# Altium schematic sheet EP3C25.SchDoc
size A2
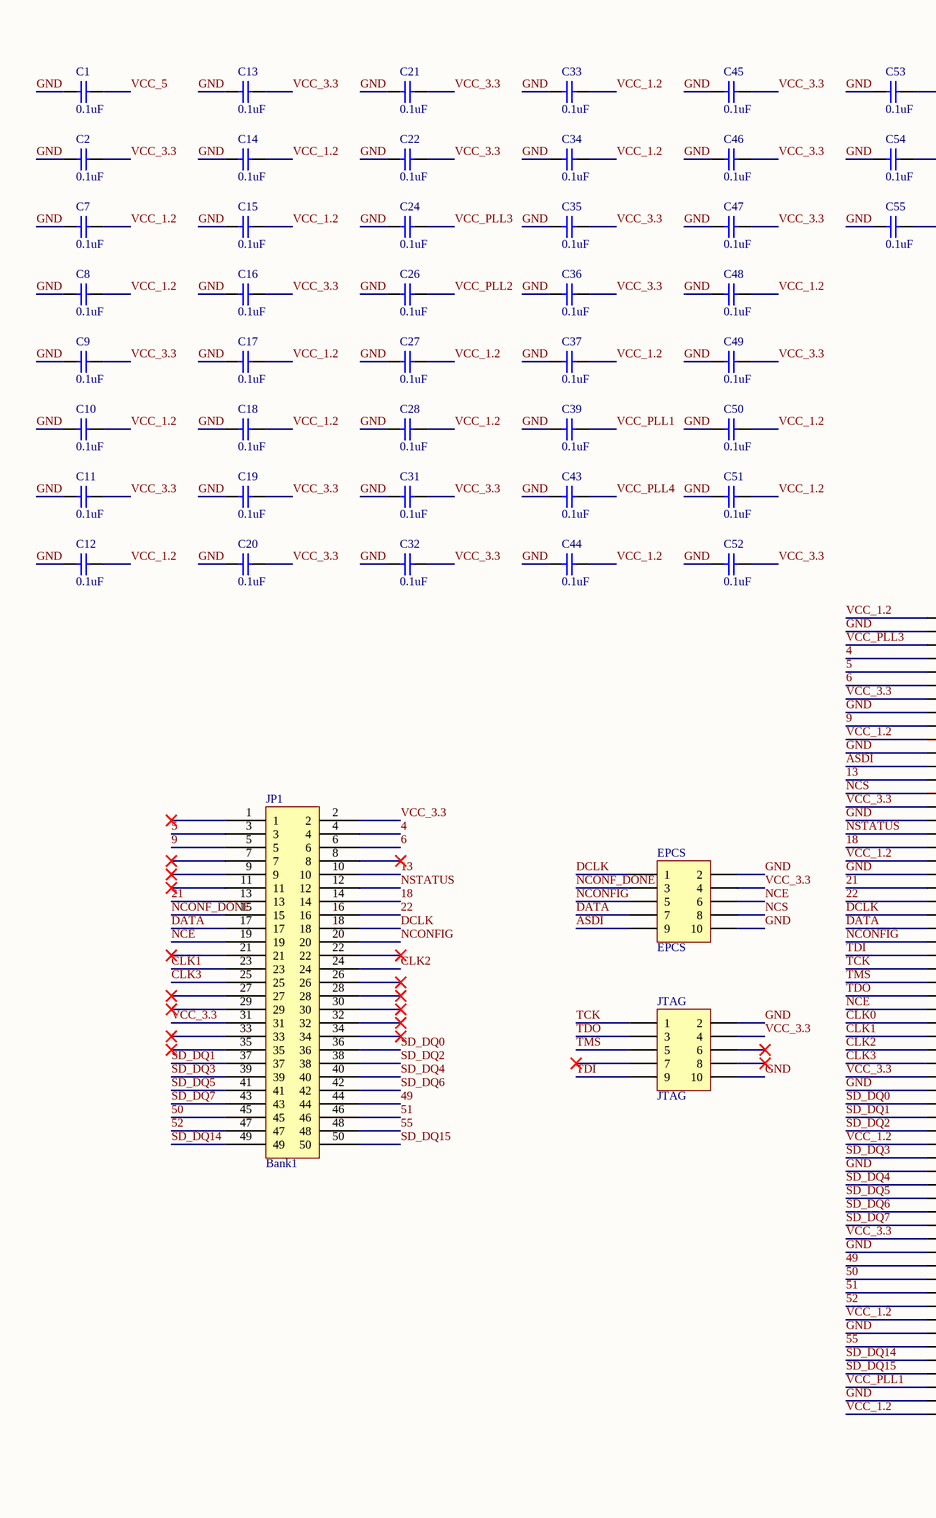
[diagram p0: EP3C25.SchDoc, left]
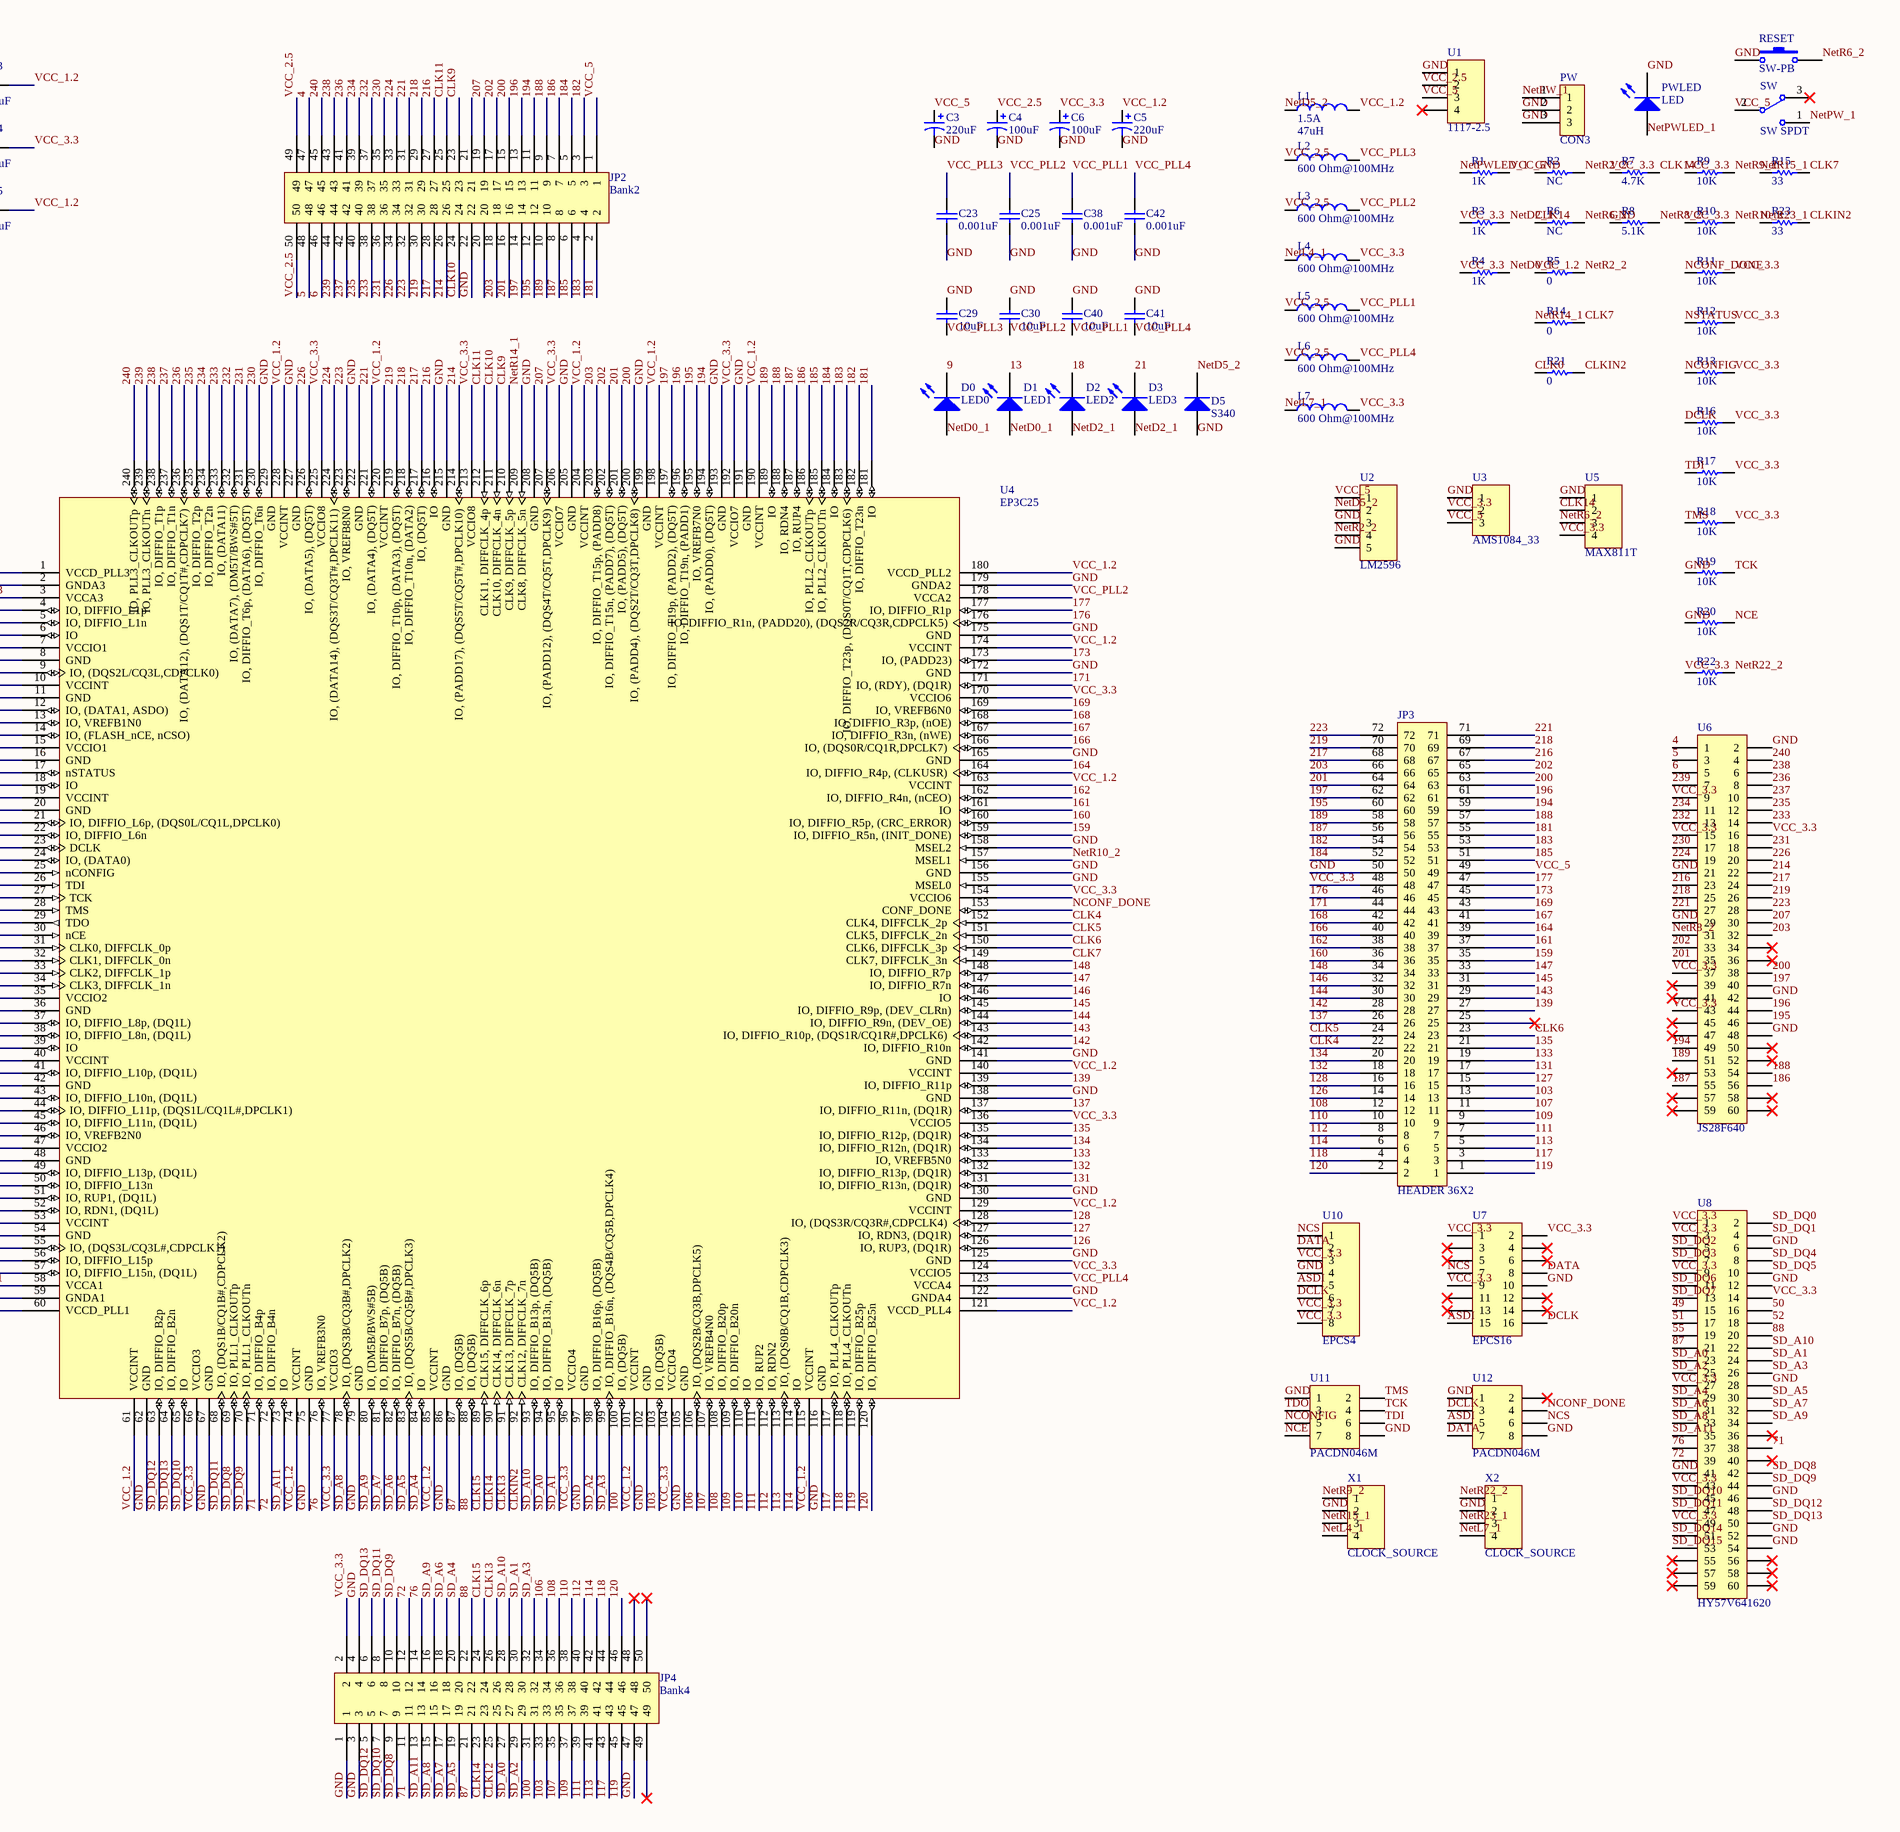
[diagram p1: EP3C25.SchDoc, right]

## Parts
C1  0.1uF  [0805C]
C2  0.1uF  [0805C]
C3  220uF  [Cap6.6*6.6]
C4  100uF  [Cap6.6*6.6]
C5  220uF  [8228]
C6  100uF  [Cap6.6*6.6]
C7  0.1uF  [0805C]
C8  0.1uF  [0805C]
C9  0.1uF  [0805C]
C10  0.1uF  [0805C]
C11  0.1uF  [0805C]
C12  0.1uF  [0805C]
C13  0.1uF  [0805C]
C14  0.1uF  [0805C]
C15  0.1uF  [0805C]
C16  0.1uF  [0805C]
C17  0.1uF  [0805C]
C18  0.1uF  [0805C]
C19  0.1uF  [0805C]
C20  0.1uF  [0805C]
C21  0.1uF  [0805C]
C22  0.1uF  [0805C]
C23  0.001uF  [0805C]
C24  0.1uF  [0805C]
C25  0.001uF  [0805C]
C26  0.1uF  [0805C]
C27  0.1uF  [0805C]
C28  0.1uF  [0805C]
C29  10uF  [3216C/A]
C30  10uF  [3216C/A]
C31  0.1uF  [0805C]
C32  0.1uF  [0805C]
C33  0.1uF  [0805C]
C34  0.1uF  [0805C]
C35  0.1uF  [0805C]
C36  0.1uF  [0805C]
C37  0.1uF  [0805C]
C38  0.001uF  [0805C]
C39  0.1uF  [0805C]
C40  10uF  [3216C/A]
C41  10uF  [3216C/A]
C42  0.001uF  [0805C]
C43  0.1uF  [0805C]
C44  0.1uF  [0805C]
C45  0.1uF  [0805C]
C46  0.1uF  [0805C]
C47  0.1uF  [0805C]
C48  0.1uF  [0805C]
C49  0.1uF  [0805C]
C50  0.1uF  [0805C]
C51  0.1uF  [0805C]
C52  0.1uF  [0805C]
C53  0.1uF  [0805C]
C54  0.1uF  [0805C]
C55  0.1uF  [0805C]
D0  LED0  [0805A]
D1  LED1  [0805A]
D2  LED2  [0805A]
D3  LED3  [0805A]
D5  S340  [SMB]
EPCS  EPCS  [IDC10_S]
JP1  Bank1  [IDC50-S]
JP2  Bank2  [IDC50-S]
JP3  HEADER 36X2  [IDC72_S]
JP4  Bank4  [IDC50-S]
JTAG  JTAG  [IDC10_S]
L1  1.5A  value 47uH  [临时画的电感封装]
L2  600 Ohm@100MHz  [0805R]
L3  600 Ohm@100MHz  [0805R]
L4  600 Ohm@100MHz  [0805R]
L5  600 Ohm@100MHz  [0805R]
L6  600 Ohm@100MHz  [0805R]
L7  600 Ohm@100MHz  [0805R]
PW  CON3  [PW_PORT]
PWLED  LED  [0805A]
R1  1K  [0805R]
R2  NC  [0805R]
R3  1K  [0805R]
R4  1K  [0805R]
R5  0  [0805R]
R6  NC  [0805R]
R7  4.7K  [0805R]
R8  5.1K  [0805R]
R9  10K  [0805R]
R10  10K  [0805R]
R11  10K  [0805R]
R12  10K  [0805R]
R13  10K  [0805R]
R14  0  [0805R]
R15  33  [0805R]
R16  10K  [0805R]
R17  10K  [0805R]
R18  10K  [0805R]
R19  10K  [0805R]
R20  10K  [0805R]
R21  0  [0805R]
R22  10K  [0805R]
R23  33  [0805R]
RESET  SW-PB  [SMD_SWITH]
SW  SW SPDT  [PW_SW]
U1  1117-2.5  [SOT-223]
U2  LM2596  [LM2596_TO263]
U3  AMS1084_33  [AMS1084-ADJ]
U4  EP3C25  [PQFP240]
U5  MAX811T  [SOT143]
U6  JS28F640  [SOP56_E28F640]
U7  EPCS16  [SOP16_EPCS16]
U8  HY57V641620  [TSOP54]
U10  EPCS4  [so8]
U11  PACDN046M  [MSOP8]
U12  PACDN046M  [MSOP8]
X1  CLOCK_SOURCE  [CRYSTAL4]
X2  CLOCK_SOURCE  [CRYSTAL4]

## Nets
4: JP1.4 JP2.47 U4.4(IO,_DIFFIO_L1p) U6.1
5: JP1.3 JP2.48 U4.5(IO,_DIFFIO_L1n) U6.3
6: JP1.6 JP2.46 U4.6(IO) U6.5
9: D0.2(K) JP1.5 U4.9(IO,_(DQS2L/CQ3L,CDPCLK0))
13: D1.2(K) JP1.10 U4.13(IO,_VREFB1N0)
18: D2.2(K) JP1.14 U4.18(IO)
21: D3.2(K) JP1.13 U4.21(IO,_DIFFIO_L6p,_(DQS0L/CQ1L,DPCLK0))
22: JP1.16 U4.22(IO,_DIFFIO_L6n)
49: JP1.44 U4.49(IO,_DIFFIO_L13p,_(DQ1L)) U8.15
50: JP1.45 U4.50(IO,_DIFFIO_L13n) U8.16
51: JP1.46 U4.51(IO,_RUP1,_(DQ1L)) U8.17
52: JP1.47 U4.52(IO,_RDN1,_(DQ1L)) U8.18
55: JP1.48 U4.55(IO,_(DQS3L/CQ3L#,CDPCLK1)) U8.19
71: JP4.11 U4.71(IO,_DIFFIO_B4p) U8.38
72: JP4.12 U4.72(IO,_DIFFIO_B4n) U8.39
76: JP4.14 U4.76(IO,_VREFB3N0) U8.37
87: JP4.21 U4.87(IO,_(DQ5B)) U8.21
88: JP4.22 U4.88(IO,_(DQ5B)) U8.20
100: JP4.31 U4.100(IO,_(DQ5B))
103: JP3.13 JP4.33 U4.103(IO,_(DQ5B))
106: JP4.34 U4.106(IO,_(DQS2B/CQ3B,DPCLK5))
107: JP3.11 JP4.35 U4.107(IO,_VREFB4N0)
108: JP3.12 JP4.36 U4.108(IO,_DIFFIO_B20p)
109: JP3.9 JP4.37 U4.109(IO,_DIFFIO_B20n)
110: JP3.10 JP4.38 U4.110(IO)
111: JP3.7 JP4.39 U4.111(IO,_RUP2)
112: JP3.8 JP4.40 U4.112(IO,_RDN2)
113: JP3.5 JP4.41 U4.113(IO,_(DQS0B/CQ1B,CDPCLK3))
114: JP3.6 JP4.42 U4.114(IO)
117: JP3.3 JP4.43 U4.117(IO,_PLL4_CLKOUTp)
118: JP3.4 JP4.44 U4.118(IO,_PLL4_CLKOUTn)
119: JP3.1 JP4.45 U4.119(IO,_DIFFIO_B25p)
120: JP3.2 JP4.46 U4.120(IO,_DIFFIO_B25n)
126: JP3.14 U4.126(IO,_RUP3,_(DQ1R))
127: JP3.15 U4.127(IO,_RDN3,_(DQ1R))
128: JP3.16 U4.128(IO,_(DQS3R/CQ3R#,CDPCLK4))
131: JP3.17 U4.131(IO,_DIFFIO_R13n,_(DQ1R))
132: JP3.18 U4.132(IO,_DIFFIO_R13p,_(DQ1R))
133: JP3.19 U4.133(IO,_VREFB5N0)
134: JP3.20 U4.134(IO,_DIFFIO_R12n,_(DQ1R))
135: JP3.21 U4.135(IO,_DIFFIO_R12p,_(DQ1R))
137: JP3.26 U4.137(IO,_DIFFIO_R11n,_(DQ1R))
139: JP3.27 U4.139(IO,_DIFFIO_R11p)
142: JP3.28 U4.142(IO,_DIFFIO_R10n)
143: JP3.29 U4.143(IO,_DIFFIO_R10p,_(DQS1R/CQ1R#,DPCLK6))
144: JP3.30 U4.144(IO,_DIFFIO_R9n,_(DEV_OE))
145: JP3.31 U4.145(IO,_DIFFIO_R9p,_(DEV_CLRn))
146: JP3.32 U4.146(IO)
147: JP3.33 U4.147(IO,_DIFFIO_R7n)
148: JP3.34 U4.148(IO,_DIFFIO_R7p)
159: JP3.35 U4.159(IO,_DIFFIO_R5n,_(INIT_DONE))
160: JP3.36 U4.160(IO,_DIFFIO_R5p,_(CRC_ERROR))
161: JP3.37 U4.161(IO)
162: JP3.38 U4.162(IO,_DIFFIO_R4n,_(nCEO))
164: JP3.39 U4.164(IO,_DIFFIO_R4p,_(CLKUSR))
166: JP3.40 U4.166(IO,_(DQS0R/CQ1R,DPCLK7))
167: JP3.41 U4.167(IO,_DIFFIO_R3n,_(nWE))
168: JP3.42 U4.168(IO,_DIFFIO_R3p,_(nOE))
169: JP3.43 U4.169(IO,_VREFB6N0)
171: JP3.44 U4.171(IO,_(RDY),_(DQ1R))
173: JP3.45 U4.173(IO,_(PADD23))
176: JP3.46 U4.176(IO,_DIFFIO_R1n,_(PADD20),_(DQS2R/CQ3R,CDPCLK5))
177: JP3.47 U4.177(IO,_DIFFIO_R1p)
181: JP2.2 JP3.55 U4.181(IO)
182: JP2.3 JP3.54 U4.182(IO,_DIFFIO_T23n)
183: JP2.4 JP3.53 U4.183(IO,_DIFFIO_T23p,_(DQS0T/CQ1T,CDPCLK6))
184: JP2.5 JP3.52 U4.184(IO)
185: JP2.6 JP3.51 U4.185(IO,_PLL2_CLKOUTn)
186: JP2.7 U4.186(IO,_PLL2_CLKOUTp) U6.56
187: JP2.8 JP3.56 U4.187(IO,_RUP4) U6.55
188: JP2.9 JP3.57 U4.188(IO,_RDN4) U6.54
189: JP2.10 JP3.58 U4.189(IO) U6.51
194: JP2.11 JP3.59 U4.194(IO,_(PADD0),_(DQ5T)) U6.49
195: JP2.12 JP3.60 U4.195(IO,_VREFB7N0) U6.46
196: JP2.13 JP3.61 U4.196(IO,_DIFFIO_T19n,_(PADD1)) U6.44
197: JP2.14 JP3.62 U4.197(IO,_DIFFIO_T19p,_(PADD2),_(DQ5T)) U6.40
200: JP2.15 JP3.63 U4.200(IO,_(PADD4),_(DQS2T/CQ3T,DPCLK8)) U6.38
201: JP2.16 JP3.64 U4.201(IO,_(PADD5),_(DQ5T)) U6.35
202: JP2.17 JP3.65 U4.202(IO,_DIFFIO_T15n,_(PADD7),_(DQ5T)) U6.33
203: JP2.18 JP3.66 U4.203(IO,_DIFFIO_T15p,_(PADD8)) U6.32
207: JP2.19 U4.207(IO,_(PADD12),_(DQS4T/CQ5T,DPCLK9)) U6.30
214: JP2.26 U4.214(IO,_(PADD17),_(DQS5T/CQ5T#,DPCLK10)) U6.22
216: JP2.27 JP3.67 U4.216(IO) U6.23
217: JP2.28 JP3.68 U4.217(IO,_(DQ5T)) U6.24
218: JP2.29 JP3.69 U4.218(IO,_DIFFIO_T10n,_(DATA2)) U6.25
219: JP2.30 JP3.70 U4.219(IO,_DIFFIO_T10p,_(DATA3),_(DQ5T)) U6.26
221: JP2.31 JP3.71 U4.221(IO,_(DATA4),_(DQ5T)) U6.27
223: JP2.32 JP3.72 U4.223(IO,_VREFB8N0) U6.28
224: JP2.33 U4.224(IO,_(DATA14),_(DQS3T/CQ3T#,DPCLK11)) U6.19
226: JP2.34 U4.226(IO,_(DATA5),_(DQ5T)) U6.20
230: JP2.35 U4.230(IO,_DIFFIO_T6n) U6.17
231: JP2.36 U4.231(IO,_DIFFIO_T6p,_(DATA6),_(DQ5T)) U6.18
232: JP2.37 U4.232(IO,_(DATA7),_(DM5T/BWS#5T)) U6.13
233: JP2.38 U4.233(IO,_(DATA11)) U6.14
234: JP2.39 U4.234(IO,_DIFFIO_T2n) U6.11
235: JP2.40 U4.235(IO,_DIFFIO_T2p) U6.12
236: JP2.41 U4.236(IO,_(DATA12),_(DQS1T/CQ1T#,CDPCLK7)) U6.8
237: JP2.42 U4.237(IO,_DIFFIO_T1n) U6.10
238: JP2.43 U4.238(IO,_DIFFIO_T1p) U6.6
239: JP2.44 U4.239(IO,_PLL3_CLKOUTn) U6.7
240: JP2.45 U4.240(IO,_PLL3_CLKOUTp) U6.4
ASDI: EPCS.9 U4.12(IO,_(DATA1,_ASDO)) U7.15 U10.5 U12.5
CLK0: R21.1 U4.31(CLK0,_DIFFCLK_0p)
CLK1: JP1.23 U4.32(CLK1,_DIFFCLK_0n)
CLK2: JP1.24 U4.33(CLK2,_DIFFCLK_1p)
CLK3: JP1.25 U4.34(CLK3,_DIFFCLK_1n)
CLK4: JP3.22 U4.152(CLK4,_DIFFCLK_2p)
CLK5: JP3.24 U4.151(CLK5,_DIFFCLK_2n)
CLK6: JP3.23 U4.150(CLK6,_DIFFCLK_3p)
CLK7: R14.2 R15.2 U4.149(CLK7,_DIFFCLK_3n)
CLK9: JP2.23 U4.210(CLK9,_DIFFCLK_5p)
CLK10: JP2.24 U4.211(CLK10,_DIFFCLK_4n)
CLK11: JP2.25 U4.212(CLK11,_DIFFCLK_4p)
CLK12: JP4.25
CLK13: JP4.26 U4.91(CLK13,_DIFFCLK_7p)
CLK14: JP4.23 R6.1 R7.2 U4.90(CLK14,_DIFFCLK_6n) U5.2
CLK15: JP4.24 U4.89(CLK15,_DIFFCLK_6p)
CLKIN2: R21.2 R23.2 U4.92(CLK12,_DIFFCLK_7n)
DATA: EPCS.7 JP1.17 U4.24(IO,_(DATA0)) U7.8 U10.2 U12.7
DCLK: EPCS.1 JP1.18 R16.1 U4.23(DCLK) U7.16 U10.6 U12.3
GND: C1.1 C2.1 C3.2 C4.2 C5.2 C6.2 C7.1 C8.1 C9.1 C10.1 C11.1 C12.1 C13.1 C14.1 C15.1 C16.1 C17.1 C18.1 C19.1 C20.1 C21.1 C22.1 C23.1 C24.1 C25.1 C26.1 C27.1 C28.1 C29.2 C30.2 C31.1 C32.1 C33.1 C34.1 C35.1 C36.1 C37.1 C38.1 C39.1 C40.2 C41.2 C42.1 C43.1 C44.1 C45.1 C46.1 C47.1 C48.1 C49.1 C50.1 C51.1 C52.1 C53.1 C54.1 C55.1 D5.1(A) EPCS.2 EPCS.10 JP2.22 JP3.50 JP4.1 JP4.3 JP4.4 JP4.47 JTAG.2 JTAG.10 PW.2 PW.3 PWLED.2(K) R2.1 R8.1 R19.1 R20.1 RESET.1 U1.1 U2.3 U2.5 U3.1 U4.2(GNDA3) U4.8(GND) U4.11(GND) U4.16(GND) U4.20(GND) U4.36(GND) U4.42(GND) U4.48(GND) U4.54(GND) U4.59(GNDA1) U4.62(GND) U4.67(GND) U4.75(GND) U4.79(GND) U4.86(GND) U4.97(GND) U4.102(GND) U4.105(GND) U4.116(GND) U4.122(GNDA4) U4.125(GND) U4.130(GND) U4.138(GND) U4.141(GND) U4.155(MSEL0) U4.156(GND) U4.158(MSEL2) U4.165(GND) U4.172(GND) U4.175(GND) U4.179(GNDA2) U4.191(GND) U4.193(GND) U4.199(GND) U4.205(GND) U4.208(GND) U4.215(GND) U4.222(GND) U4.227(GND) U4.229(GND) U5.1 U6.2 U6.21 U6.29 U6.42 U6.48 U7.10 U8.6 U8.12 U8.28 U8.41 U8.46 U8.52 U8.54 U10.4 U11.1 U11.8 U12.1 U12.8 X1.2 X2.2
NCE: EPCS.6 JP1.19 R20.2 U4.30(nCE) U11.7
NCONF_DONE: EPCS.3 JP1.15 R11.1 U4.153(CONF_DONE) U12.4
NCONFIG: EPCS.5 JP1.20 R13.1 U4.25(nCONFIG) U11.5
NCS: EPCS.8 U4.14(IO,_(FLASH_nCE,_nCSO)) U7.7 U10.1 U12.6
NetD0_1: D0.1(A) D1.1(A) R4.2
NetD2_1: D2.1(A) D3.1(A) R3.2
NetD5_2: D5.2(K) L1.1 U2.2
NetL4_1: L4.1 X1.4
NetL7_1: L7.1 X2.4
NetPW_1: PW.1 SW.1
NetPWLED_1: PWLED.1(A) R1.1
NetR2_2: R2.2 R5.2 U2.4
NetR6_2: R6.2 RESET.2 U5.3
NetR8_2: R8.2 U6.31
NetR9_2: R9.2 X1.1
NetR10_2: R10.2 U4.157(MSEL1)
NetR14_1: R14.1 U4.209(CLK8,_DIFFCLK_5n)
NetR15_1: R15.1 X1.3
NetR22_2: R22.2 X2.1
NetR23_1: R23.1 X2.3
NSTATUS: JP1.12 R12.1 U4.17(nSTATUS)
SD_A0: JP4.27 U4.94(IO,_DIFFIO_B13n,_(DQ5B)) U8.23
SD_A1: JP4.30 U4.95(IO) U8.24
SD_A2: JP4.29 U4.98(IO,_DIFFIO_B16p,_(DQ5B)) U8.25
SD_A3: JP4.32 U4.99(IO,_DIFFIO_B16n,_(DQS4B/CQ5B,DPCLK4)) U8.26
SD_A4: JP4.20 U4.84(IO) U8.29
SD_A5: JP4.19 U4.83(IO,_(DQS5B/CQ5B#,DPCLK3)) U8.30
SD_A6: JP4.18 U4.82(IO,_DIFFIO_B7n,_(DQ5B)) U8.31
SD_A7: JP4.17 U4.81(IO,_DIFFIO_B7p,_(DQ5B)) U8.32
SD_A8: JP4.15 U4.78(IO,_(DQS3B/CQ3B#,DPCLK2)) U8.33
SD_A9: JP4.16 U4.80(IO,_(DM5B/BWS#5B)) U8.34
SD_A10: JP4.28 U4.93(IO,_DIFFIO_B13p,_(DQ5B)) U8.22
SD_A11: JP4.13 U4.73(IO) U8.35
SD_DQ0: JP1.36 U4.37(IO,_DIFFIO_L8p,_(DQ1L)) U8.2
SD_DQ1: JP1.37 U4.38(IO,_DIFFIO_L8n,_(DQ1L)) U8.4
SD_DQ2: JP1.38 U4.39(IO) U8.5
SD_DQ3: JP1.39 U4.41(IO,_DIFFIO_L10p,_(DQ1L)) U8.7
SD_DQ4: JP1.40 U4.43(IO,_DIFFIO_L10n,_(DQ1L)) U8.8
SD_DQ5: JP1.41 U4.44(IO,_DIFFIO_L11p,_(DQS1L/CQ1L#,DPCLK1)) U8.10
SD_DQ6: JP1.42 U4.45(IO,_DIFFIO_L11n,_(DQ1L)) U8.11
SD_DQ7: JP1.43 U4.46(IO,_VREFB2N0) U8.13
SD_DQ8: JP4.9 U4.69(IO,_PLL1_CLKOUTp) U8.42
SD_DQ9: JP4.10 U4.70(IO,_PLL1_CLKOUTn) U8.44
SD_DQ10: JP4.7 U4.65(IO) U8.45
SD_DQ11: JP4.8 U4.68(IO,_(DQS1B/CQ1B#,CDPCLK2)) U8.47
SD_DQ12: JP4.5 U4.63(IO,_DIFFIO_B2p) U8.48
SD_DQ13: JP4.6 U4.64(IO,_DIFFIO_B2n) U8.50
SD_DQ14: JP1.49 U4.56(IO,_DIFFIO_L15p) U8.51
SD_DQ15: JP1.50 U4.57(IO,_DIFFIO_L15n,_(DQ1L)) U8.53
TCK: JTAG.1 R19.2 U4.27(TCK) U11.4
TDI: JTAG.9 R17.1 U4.26(TDI) U11.6
TDO: JTAG.3 U4.29(TDO) U11.3
TMS: JTAG.5 R18.1 U4.28(TMS) U11.2
VCC_1.2: C5.1 C7.2 C8.2 C10.2 C12.2 C14.2 C15.2 C17.2 C18.2 C27.2 C28.2 C33.2 C34.2 C37.2 C44.2 C48.2 C50.2 C51.2 C53.2 C55.2 L1.2 R5.1 U4.1(VCCD_PLL3) U4.10(VCCINT) U4.19(VCCINT) U4.40(VCCINT) U4.53(VCCINT) U4.60(VCCD_PLL1) U4.61(VCCINT) U4.74(VCCINT) U4.85(VCCINT) U4.101(VCCINT) U4.115(VCCINT) U4.121(VCCD_PLL4) U4.129(VCCINT) U4.140(VCCINT) U4.163(VCCINT) U4.174(VCCINT) U4.180(VCCD_PLL2) U4.190(VCCINT) U4.198(VCCINT) U4.204(VCCINT) U4.220(VCCINT) U4.228(VCCINT)
VCC_2.5: C4.1 JP2.49 JP2.50 L2.1 L3.1 L5.1 L6.1 U1.2
VCC_3.3: C2.2 C6.1 C9.2 C11.2 C13.2 C16.2 C19.2 C20.2 C21.2 C22.2 C31.2 C32.2 C35.2 C36.2 C45.2 C46.2 C47.2 C49.2 C52.2 C54.2 EPCS.4 JP1.2 JP1.31 JP3.48 JP4.2 JTAG.4 L4.2 L7.2 R3.1 R4.1 R7.1 R9.1 R10.1 R11.2 R12.2 R13.2 R16.2 R17.2 R18.2 R22.1 U3.2 U4.7(VCCIO1) U4.15(VCCIO1) U4.35(VCCIO2) U4.47(VCCIO2) U4.66(VCCIO3) U4.77(VCCIO3) U4.96(VCCIO4) U4.104(VCCIO4) U4.124(VCCIO5) U4.136(VCCIO5) U4.154(VCCIO6) U4.170(VCCIO6) U4.192(VCCIO7) U4.206(VCCIO7) U4.213(VCCIO8) U4.225(VCCIO8) U5.4 U6.9 U6.15 U6.16 U6.37 U6.43 U7.1 U7.2 U7.9 U8.1 U8.3 U8.9 U8.14 U8.27 U8.43 U8.49 U10.3 U10.7 U10.8
VCC_5: C1.2 C3.1 JP2.1 JP3.49 R1.2 SW.2 U1.3 U2.1 U3.3
VCC_PLL1: C38.2 C39.2 C40.1 L5.2 U4.58(VCCA1)
VCC_PLL2: C25.2 C26.2 C30.1 L3.2 U4.178(VCCA2)
VCC_PLL3: C23.2 C24.2 C29.1 L2.2 U4.3(VCCA3)
VCC_PLL4: C41.1 C42.2 C43.2 L6.2 U4.123(VCCA4)

Not connected (* = marked no-connect by the designer): JP1 1* 7* 8* 9* 11* 21* 22* 26* 27* 28* 29* 30* 32* 33* 34* 35*; JP2 20 21; JP3 25*; JP4 48* 49* 50*; JTAG 6* 7* 8*; SW 3*; U1 4*; U6 34* 36* 39* 41* 45* 47* 50* 52* 53* 57* 58* 59* 60*; U7 3* 4* 5* 6* 11* 12* 13* 14*; U8 36* 40* 55* 56* 57* 58* 59* 60*; U12 2*

## Library data of the parts
C1 C2 C7-C55 = Cap: Capacitor; Published: 8-Jun-2000; LatestRevisionDate: 17-Jul-2002; LatestRevisionNote: Re-released for DXP Platform.; PackageReference: RAD-0.3; Publisher: Altium Limited
C3-C6 = Cap Pol1: Polarized Capacitor (Radial); Published: 8-Jun-2000; LatestRevisionDate: 17-Jul-2002; LatestRevisionNote: Re-released for DXP Platform.; PackageReference: RB7.6-15; Publisher: Altium Limited
D0-D3 PWLED = LED0: Typical INFRARED GaAs LED; Published: 8-Jun-2000; LatestRevisionDate: 08-Jul-2005; LatestRevisionNote: Mech Layer 1 removed.; PackageReference: LED-0; Publisher: Altium Limited
D5 = Diode: Default Diode; Published: 8-Jun-2000; LatestRevisionDate: 17-Jul-2002; LatestRevisionNote: Re-released for DXP Platform.; PackageDocument: Sep-1996; PackageReference: SMC; Publisher: Altium Limited; Code_JEDEC: DO-214-AB
EPCS JTAG = Header 5X2: Header, 5-Pin, Dual row; LatestRevisionDate: 17-Jul-2002; LatestRevisionNote: Re-released for DXP Platform.; Publisher: Altium Limited
JP1 = CORE_CONNECTOR_LEFT
JP2 = CORE_CONNECTOR_FRONT
JP3 = CORE_CONNECTOR_RIGHT
JP4 = CORE_CONNECTOR_BACK
L1-L7 = Inductor: Code_IEC: 1005; Published: 8-Jun-2000; LatestRevisionDate: 17-Jul-2002; LatestRevisionNote: Re-released for DXP Platform.; PackageReference: 0402-A; Publisher: Altium Limited; Code_JEITA: 0402
R1-R23 = Res1: Resistor; Published: 8-Jun-2000; LatestRevisionDate: 17-Jul-2002; LatestRevisionNote: Re-released for DXP Platform.; PackageReference: AXIAL-0.3; Publisher: Altium Limited
RESET = SW-PB: Switch; Published: 24-Mar-1999; LatestRevisionDate: 17-Jul-2002; LatestRevisionNote: Re-released for DXP Platform.; PackageReference: SPST-2; Publisher: Altium Limited
SW = SW-SPDT: SPDT Subminiature Toggle Switch, Right Angle Mounting, Vertical Actuation; Published: 24-Mar-1999; LatestRevisionDate: 17-Dec-2003; LatestRevisionNote: Schematic revised, PCB Footprint replaced.; DatasheetDocument: 05-Dec-2000; PackageReference: TL36WW15050; Publisher: Altium Limited; ComponentLink1Description: Manufacturer Link; ComponentLink1URL: http://www.apem.com
U1 U5 X1 X2 = Header 4: Header, 4-Pin; LatestRevisionDate: 17-Jul-2002; LatestRevisionNote: Re-released for DXP Platform.; Publisher: Altium Limited
U2 = Header 5: Header, 5-Pin; LatestRevisionDate: 17-Jul-2002; LatestRevisionNote: Re-released for DXP Platform.; Publisher: Altium Limited
U3 = Header 3: Header, 3-Pin; LatestRevisionDate: 17-Jul-2002; LatestRevisionNote: Re-released for DXP Platform.; Publisher: Altium Limited
U4 = EP3C25Q240C8
U6 U8 = Header 30X2: Header, 30-Pin, Dual row; LatestRevisionDate: 17-Jul-2002; LatestRevisionNote: Re-released for DXP Platform.; Publisher: Altium Limited
U7 = Header 8X2: Header, 8-Pin, Dual row; LatestRevisionDate: 17-Jul-2002; LatestRevisionNote: Re-released for DXP Platform.; Publisher: Altium Limited
U10 = Header 8: Header, 8-Pin; LatestRevisionDate: 17-Jul-2002; LatestRevisionNote: Re-released for DXP Platform.; Publisher: Altium Limited
U11 U12 = Header 4X2: Header, 4-Pin, Dual row; LatestRevisionDate: 17-Jul-2002; LatestRevisionNote: Re-released for DXP Platform.; Publisher: Altium Limited